# Altium schematic sheet RP2040_WEDS.SchDoc
size 297 x 209 mm
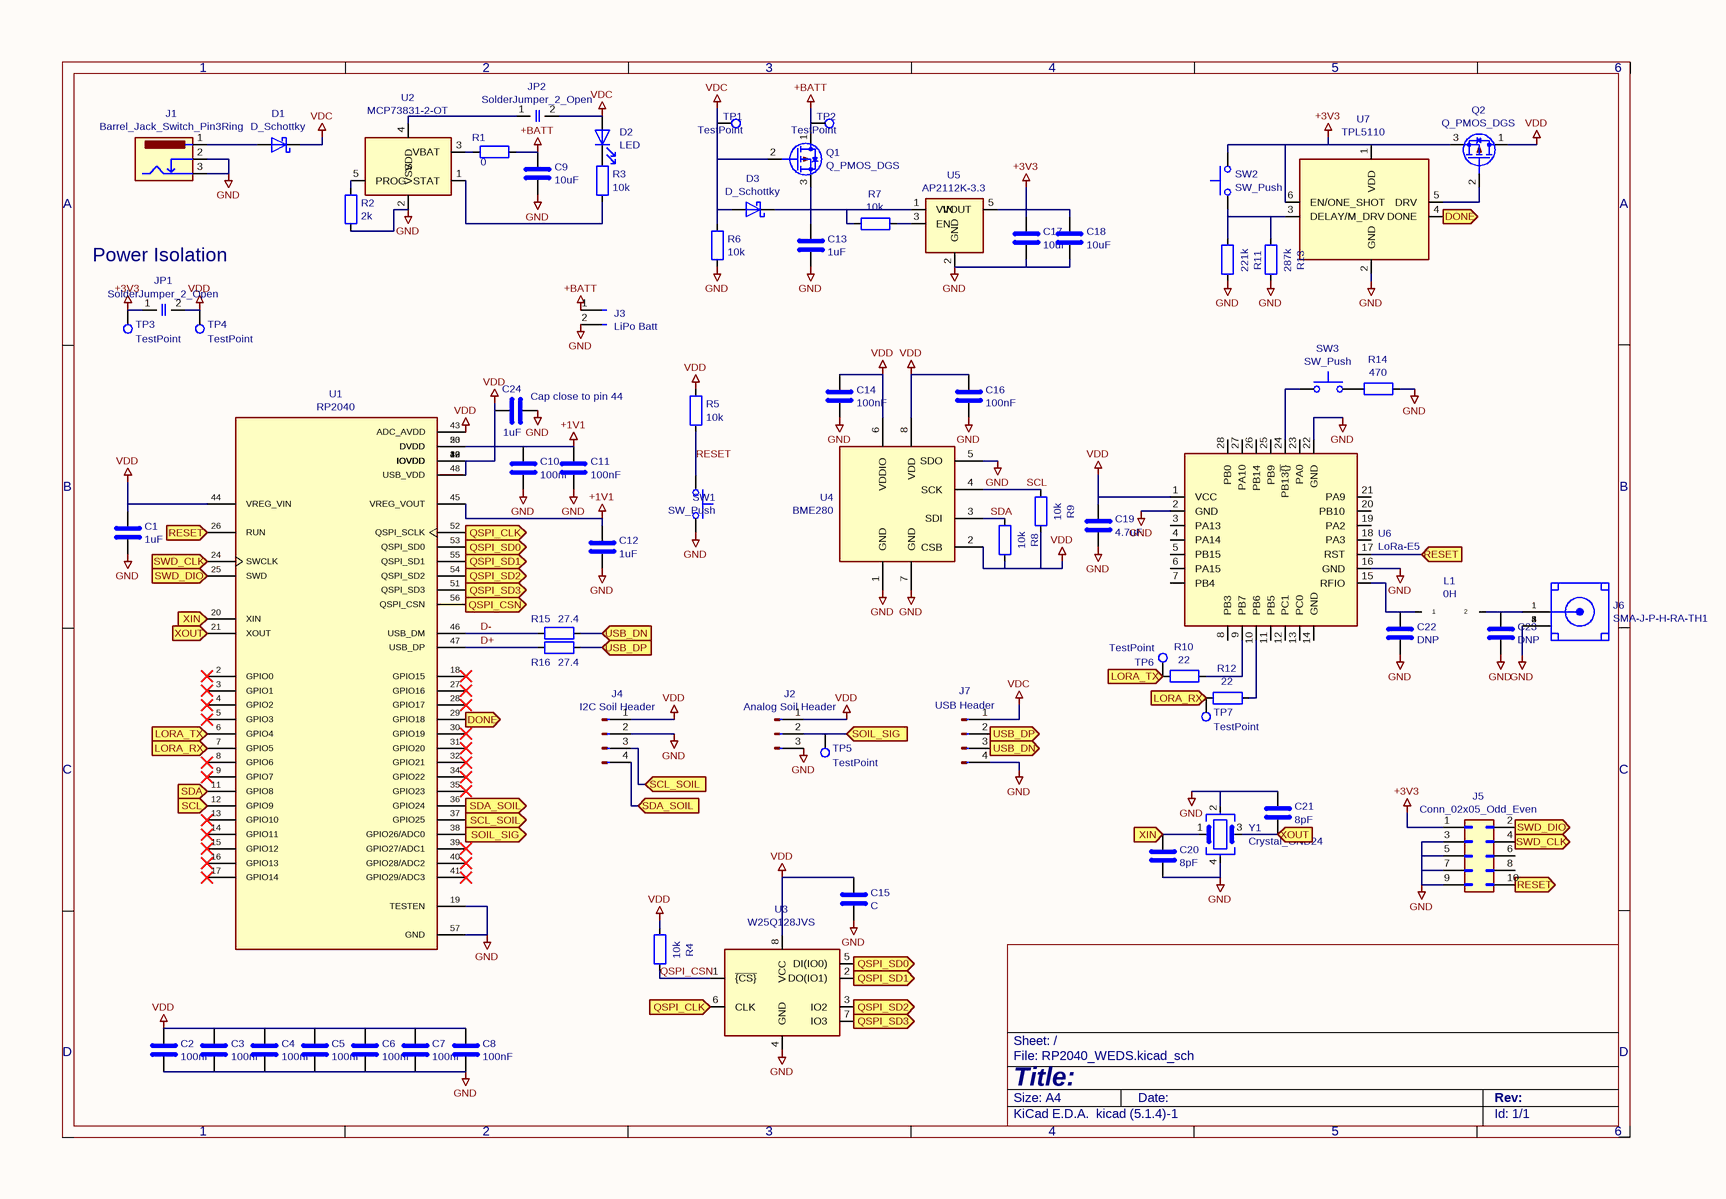
[diagram p0: RP2040_WEDS.SchDoc]

## Parts
C1  1uF  [C_0603_1608Metric]
C2  100nF  [C_0603_1608Metric]
C3  100nF  [C_0603_1608Metric]
C4  100nF  [C_0603_1608Metric]
C5  100nF  [C_0603_1608Metric]
C6  100nF  [C_0603_1608Metric]
C7  100nF  [C_0603_1608Metric]
C8  100nF  [C_0603_1608Metric]
C9  10uF  [C_0603_1608Metric]
C10  100nF  [C_0603_1608Metric]
C11  100nF  [C_0603_1608Metric]
C12  1uF  [C_0603_1608Metric]
C13  1uF  [C_0603_1608Metric]
C14  100nF  [C_0603_1608Metric]
C15  C  [C_0603_1608Metric]
C16  100nF  [C_0603_1608Metric]
C17  10uF  [C_0603_1608Metric]
C18  10uF  [C_0603_1608Metric]
C19  4.7uF  [C_0603_1608Metric]
C20  8pF  [C_0603_1608Metric]
C21  8pF  [C_0603_1608Metric]
C22  DNP  [C_0603_1608Metric]
C23  DNP  [C_0603_1608Metric]
C24  1uF  [C_0603_1608Metric]
D1  D_Schottky  [D_SOD-323]
D2  LED  [LED_0603_1608Metric]
D3  D_Schottky  [D_SOD-323]
J1  Barrel_Jack_Switch_Pin3Ring  [54-00125]
J2  Analog Soil Header  [PinHeader_1x03_P1.27mm_Vertical]
J3  LiPo Batt  [PinHeader_2x01_P1.27mm_Vertical]
J4  I2C Soil Header  [PinHeader_1x04_P1.27mm_Vertical]
J5  Conn_02x05_Odd_Even  [PinHeader_2x05_P1.27mm_Vertical_SMD]
J6  SMA-J-P-H-RA-TH1  [SMA_Amphenol_132289_EdgeMount_new]
J7  USB Header  [PinHeader_1x04_P1.27mm_Vertical]
JP1  SolderJumper_2_Open  [SolderJumper-2_P1.3mm_Open_RoundedPad1.0x1.5mm]
JP2  SolderJumper_2_Open  [SolderJumper-2_P1.3mm_Open_RoundedPad1.0x1.5mm]
L1  0H  [L_0603_1608Metric]
Q1  Q_PMOS_DGS  [SOT-23]
Q2  Q_PMOS_DGS  [SOT-23]
R1  0  [R_0603_1608Metric]
R2  2k  [R_0603_1608Metric]
R3  10k  [R_0603_1608Metric]
R4  10k  [R_0603_1608Metric]
R5  10k  [R_0603_1608Metric]
R6  10k  [R_0603_1608Metric]
R7  10k  [R_0603_1608Metric]
R8  10k  [R_0603_1608Metric]
R9  10k  [R_0603_1608Metric]
R10  22  [R_0603_1608Metric]
R11  221k  [R_0603_1608Metric]
R12  22  [R_0603_1608Metric]
R13  287k  [R_0603_1608Metric]
R14  470  [R_0603_1608Metric]
R15  27.4  [R_0603_1608Metric]
R16  27.4  [R_0603_1608Metric]
SW1  SW_Push  [SW_Push_1P1T_NO_6x6mm_H9.5mm]
SW2  SW_Push  [SW_Push_1P1T_NO_6x6mm_H9.5mm]
SW3  SW_Push  [SW_Push_1P1T_NO_6x6mm_H9.5mm]
TP1  TestPoint  [TestPoint_Loop_D1.80mm_Drill1.0mm_Beaded]
TP2  TestPoint  [TestPoint_Loop_D1.80mm_Drill1.0mm_Beaded]
TP3  TestPoint  [TestPoint_Loop_D1.80mm_Drill1.0mm_Beaded]
TP4  TestPoint  [TestPoint_Loop_D1.80mm_Drill1.0mm_Beaded]
TP5  TestPoint  [TestPoint_Loop_D1.80mm_Drill1.0mm_Beaded]
TP6  TestPoint  [TestPoint_Loop_D1.80mm_Drill1.0mm_Beaded]
TP7  TestPoint  [TestPoint_Loop_D1.80mm_Drill1.0mm_Beaded]
U1  RP2040  [QFN40P700X700X90-57N]
U2  MCP73831-2-OT  [SOT-23-5]
U3  W25Q128JVS  [SOIC-8_5.23x5.23mm_P1.27mm]
U4  BME280  [Bosch_LGA-8_2.5x2.5mm_P0.65mm_ClockwisePinNumbering]
U5  AP2112K-3.3  [SOT-23-5]
U6  LoRa-E5  [LoRa-E5]
U7  TPL5110  [SOT-23-6]
Y1  Crystal_GND24  [Oscillator_SMD_Abracon_ASDMB-4Pin_2.5x2.0mm]

## Ports
DONE (in), LORA_RX (in), LORA_TX (in), QSPI_CLK (in), QSPI_CSN (in), QSPI_SD0 (in), QSPI_SD1 (in), QSPI_SD2 (in), QSPI_SD3 (in), RESET (in), SCL (in), SCL_SOIL (in), SDA (in), SDA_SOIL (in), SOIL_SIG (in), SWD_CLK (in), SWD_DIO (in), USB_DN (in), USB_DP (in), XIN (in), XOUT (in)

## Nets
+1V1: C10.1 C11.1 C12.1 U1.23(DVDD) U1.45(VREG_VOUT) U1.50(DVDD)
+3V3: C17.1 C18.1 J5.1(Pin_1) JP1.1(A) Q2.3(S) SW2.2 TP3.1 U5.5(VOUT) U7.1(VDD) U7.6(EN/ONE_SHOT)
+BATT: C9.1 J3.1(Pin_1) Q1.1(D) R1.1 TP2.1
GND: C1.2 C2.2 C3.2 C4.2 C5.2 C6.2 C7.2 C8.2 C9.2 C10.2 C11.2 C12.2 C13.2 C14.2 C15.2 C16.2 C17.2 C18.2 C19.2 C20.2 C21.1 C22.2 C23.2 C24.2 J1.2 J1.3 J2.3(Pin_3) J3.2(Pin_2) J4.2(Pin_2) J5.3(Pin_3) J5.5(Pin_5) J5.7(Pin_7) J5.9(Pin_9) J6.2 J6.3 J6.4 J6.5 J7.4(Pin_4) R2.1 R6.2 R11.1 R13.1 R14.1 SW1.2 U1.19(TESTEN) U1.57(GND) U2.2(VSS) U3.4(GND) U4.1(GND) U4.5(SDO) U4.7(GND) U5.2(GND) U6.2(GND) U6.16(GND) U6.22(GND) U7.2(GND) Y1.2 Y1.4
VDC: D1.1(K) D2.2(A) D3.2(A) J7.1(Pin_1) JP2.2(B) Q1.2(G) R6.1 TP1.1
VDD: C1.1 C2.1 C3.1 C4.1 C5.1 C6.1 C7.1 C8.1 C14.1 C15.1 C16.1 C19.1 C24.1 J2.1(Pin_1) J4.1(Pin_1) JP1.2(B) Q2.1(D) R4.2 R5.1 R8.1 R9.1 TP4.1 U1.1(IOVDD) U1.10(IOVDD) U1.22(IOVDD) U1.33(IOVDD) U1.42(IOVDD) U1.43(ADC_AVDD) U1.44(VREG_VIN) U1.48(USB_VDD) U1.49(IOVDD) U3.8(VCC) U4.2(CSB) U4.6(VDDIO) U4.8(VDD) U6.1(VCC)
D+: R16.1 U1.47(USB_DP)
D-: R15.1 U1.46(USB_DM)
DONE: U1.29(GPIO18) U7.4(DONE) ; port DONE
LORA_RX: R12.2 TP7.1 U1.7(GPIO5) ; port LORA_RX
LORA_TX: R10.2 TP6.1 U1.6(GPIO4) ; port LORA_TX
QSPI_CLK: U1.52(QSPI_SCLK) U3.6(CLK) ; port QSPI_CLK
QSPI_CSN: R4.1 U3.1(~{{CS}})
QSPI_CSN: U1.56(QSPI_CSN) ; port QSPI_CSN  [a separate net that carries the same name]
QSPI_SD0: U1.53(QSPI_SD0) U3.5(DI(IO0)) ; port QSPI_SD0
QSPI_SD1: U1.55(QSPI_SD1) U3.2(DO(IO1)) ; port QSPI_SD1
QSPI_SD2: U1.54(QSPI_SD2) U3.3(IO2) ; port QSPI_SD2
QSPI_SD3: U1.51(QSPI_SD3) U3.7(IO3) ; port QSPI_SD3
RESET: J5.10(Pin_10) U1.26(RUN) U6.17(RST) ; port RESET
RESET: R5.2 SW1.1  [a separate net that carries the same name]
SCL: R9.2 U4.4(SCK)
SCL: U1.12(GPIO9) ; port SCL  [a separate net that carries the same name]
SCL_SOIL: J4.3(Pin_3) U1.37(GPIO25) ; port SCL_SOIL
SDA: R8.2 U4.3(SDI)
SDA: U1.11(GPIO8) ; port SDA  [a separate net that carries the same name]
SDA_SOIL: J4.4(Pin_4) U1.36(GPIO24) ; port SDA_SOIL
SOIL_SIG: J2.2(Pin_2) TP5.1 U1.38(GPIO26/ADC0) ; port SOIL_SIG
SWD_CLK: J5.4(Pin_4) U1.24(SWCLK) ; port SWD_CLK
SWD_DIO: J5.2(Pin_2) U1.25(SWD) ; port SWD_DIO
USB_DN: J7.3(Pin_3) R15.2 ; port USB_DN
USB_DP: J7.2(Pin_2) R16.2 ; port USB_DP
XIN: C20.1 U1.20(XIN) Y1.1 ; port XIN
XOUT: C21.2 U1.21(XOUT) Y1.3 ; port XOUT
NetC13_1: C13.1 D3.1(K) Q1.3(S) R7.2 U5.1(VIN)
NetC22_1: C22.1 L1.1 U6.15(RFIO)
NetC23_1: C23.1 J6.1 L1.2
NetD1_2: D1.2(A) J1.1
NetD2_1: D2.1(K) R3.1
NetJP2_1: JP2.1(A) U2.4(VDD)
NetQ2_2: Q2.2(G) U7.5(DRV)
NetR1_2: R1.2 U2.3(VBAT)
NetR2_2: R2.2 U2.5(PROG)
NetR3_2: R3.2 U2.1(STAT)
NetR7_1: R7.1 U5.3(EN)
NetR10_1: R10.1 U6.9(PB7)
NetR11_2: R11.2 R13.2 SW2.1 U7.3(DELAY/M_DRV)
NetR12_1: R12.1 U6.10(PB6)
NetR14_2: R14.2 SW3.2
NetSW3_1: SW3.1 U6.24(PB13~{{}})

Not connected (* = marked no-connect by the designer): J5 6(Pin_6) 8(Pin_8); U1 2(GPIO0)* 3(GPIO1)* 4(GPIO2)* 5(GPIO3)* 8(GPIO6)* 9(GPIO7)* 13(GPIO10)* 14(GPIO11)* 15(GPIO12)* 16(GPIO13)* 17(GPIO14)* 18(GPIO15)* 27(GPIO16)* 28(GPIO17)* 30(GPIO19)* 31(GPIO20)* 32(GPIO21)* 34(GPIO22)* 35(GPIO23)* 39(GPIO27/ADC1)* 40(GPIO28/ADC2)* 41(GPIO29/ADC3)*; U5 4(NC); U6 3(PA13) 4(PA14) 5(PB15) 6(PA15) 7(PB4) 8(PB3) 11(PB5) 12(PC1) 13(PC0) 14(GND) 18(PA3) 19(PA2) 20(PB10) 21(PA9) 23(PA0) 25(PB9) 26(PB14) 27(PA10) 28(PB0)

## Notes on the sheet
- Power Isolation
- (near C24) Cap close to pin 44
- 1
- 2
- 3
- 4
- 5
- 6
- A
- B
- C
- D
- Title:
- File: RP2040_WEDS.kicad_sch
- Sheet: /
- KiCad E.D.A.  kicad (5.1.4)-1
- Size: A4
- Date:
- Rev:
- Id: 1/1

## Library data of the parts
C1-C14 C16-C24 = C: Footprint: Capacitor_SMD:C_0603_1608Metric
  C1 C12 C13 C24: Value: 1uF
  C2-C8 C10 C11 C14 C16: Value: 100nF
  C9 C17 C18: Value: 10uF
  C19: Value: 4.7uF
  C20 C21: Value: 8pF
  C22 C23: Value: DNP
J2 = Conn_01x03_Male: Value: Analog Soil Header; Footprint: Connector_PinHeader_1.27mm:PinHeader_1x03_P1.27mm_Vertical
J3 = Conn_01x02_Female: Value: LiPo Batt; Footprint: Connector_PinHeader_1.27mm:PinHeader_2x01_P1.27mm_Vertical
J4 J7 = Conn_01x04_Male: Footprint: Connector_PinHeader_1.27mm:PinHeader_1x04_P1.27mm_Vertical
  J4: Value: I2C Soil Header
  J7: Value: USB Header
J6 = SMA-J-P-H-RA-TH1: MANUFACTURER: Samtec; STANDARD: Manufacturer recommendations; PARTREV: K; Value: SMA-J-P-H-RA-TH1; Footprint: 54-00125:SMA_Amphenol_132289_EdgeMount_new
L1 = INDUCTOR: Value: 0H; Footprint: Inductor_SMD:L_0603_1608Metric
R1-R16 = R: Footprint: Resistor_SMD:R_0603_1608Metric
  R1: Value: 0
  R2: Value: 2k
  R3-R9: Value: 10k
  R10 R12: Value: 22
  R11: Value: 221k
  R13: Value: 287k
  R14: Value: 470
  R15 R16: Value: 27.4
U1 = RP2040: MANUFACTURER: Raspberry Pi; PARTREV: 1.6.1; MAXIMUM_PACKAGE_HEIGHT: 0.9 mm; STANDARD: IPC 7351B; Value: RP2040; Footprint: RP2040KICAD:QFN40P700X700X90-57N
C15 = C: Value: C; Footprint: Capacitor_SMD:C_0603_1608Metric
D1 D3 = D_Schottky: Value: D_Schottky; Footprint: Diode_SMD:D_SOD-323
D2 = LED: Value: LED; Footprint: LED_SMD:LED_0603_1608Metric
J1 = Barrel_Jack_Switch_Pin3Ring: Value: Barrel_Jack_Switch_Pin3Ring; Footprint: 54-00125:54-00125
J5 = Conn_02x05_Odd_Even: Value: Conn_02x05_Odd_Even; Footprint: Connector_PinHeader_1.27mm:PinHeader_2x05_P1.27mm_Vertical_SMD
JP1 JP2 = SolderJumper_2_Open: Value: SolderJumper_2_Open; Footprint: Jumper:SolderJumper-2_P1.3mm_Open_RoundedPad1.0x1.5mm
Q1 Q2 = Q_PMOS_DGS: Value: Q_PMOS_DGS; Footprint: Package_TO_SOT_SMD:SOT-23
SW1-SW3 = SW_Push: Value: SW_Push; Footprint: Button_Switch_SMD:SW_Push_1P1T_NO_6x6mm_H9.5mm
TP1-TP7 = TestPoint: Value: TestPoint; Footprint: TestPoint:TestPoint_Loop_D1.80mm_Drill1.0mm_Beaded
U2 = MCP73831-2-OT: Value: MCP73831-2-OT; Footprint: Package_TO_SOT_SMD:SOT-23-5
U3 = W25Q128JVS: Value: W25Q128JVS; Footprint: Package_SO:SOIC-8_5.23x5.23mm_P1.27mm
U4 = BME280: Value: BME280; Footprint: Package_LGA:Bosch_LGA-8_2.5x2.5mm_P0.65mm_ClockwisePinNumbering
U5 = AP2112K-3.3: Value: AP2112K-3.3; Footprint: Package_TO_SOT_SMD:SOT-23-5
U6 = LoRa-E5: Value: LoRa-E5; Footprint: LoRa-E5:LoRa-E5
U7 = TPL5110: Value: TPL5110; Footprint: Package_TO_SOT_SMD:SOT-23-6
Y1 = Crystal_GND24: Value: Crystal_GND24; Footprint: Oscillator:Oscillator_SMD_Abracon_ASDMB-4Pin_2.5x2.0mm